# EAGLE design ATMega_16_demo (EAGLE 5.11)
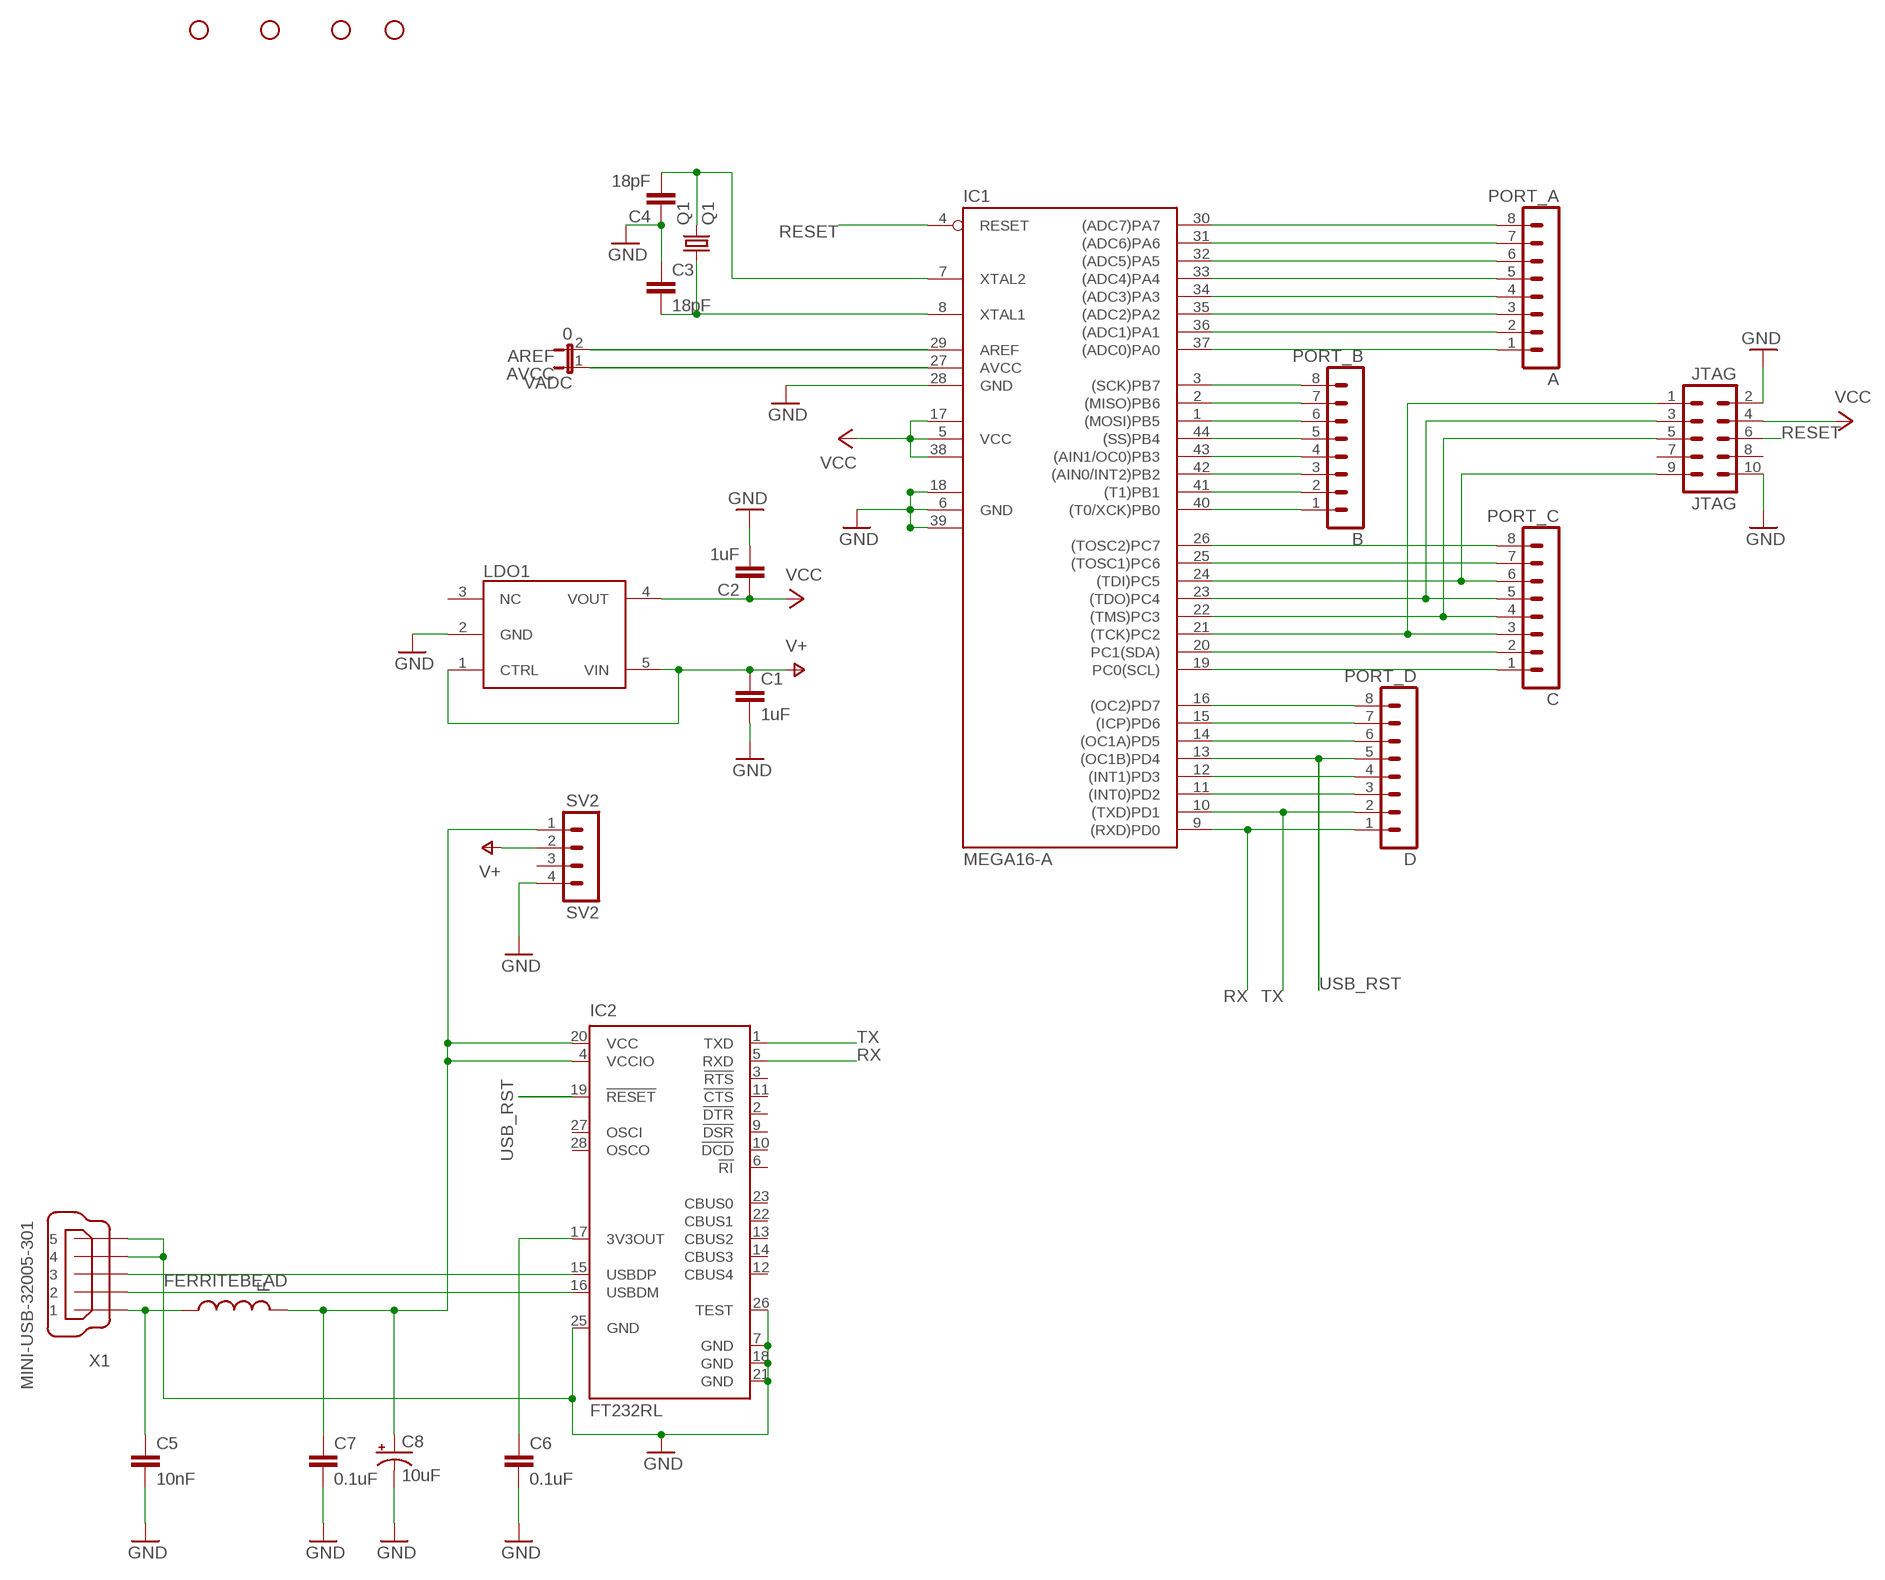
[diagram p0: schematic, sheet 1]

## Parts
C1  1uF  CAP0603-CAP  [0603-CAP]
C2  1uF  CAP0603-CAP  [0603-CAP]
C3  18pF  CAP0603-CAP  [0603-CAP]
C4  18pF  CAP0603-CAP  [0603-CAP]
C5  10nF  CAP0603-CAP  [0603-CAP]
C6  0.1uF  CAP0603-CAP  [0603-CAP]
C7  0.1uF  CAP0603-CAP  [0603-CAP]
C8  10uF  CAP_POL1206  [EIA3216]
FERRITEBEAD  F  INDUCTOR0603  [0603]
IC1  MEGA16-A  [TQFP44]
IC2  FT232RL  [SSOP28]
JP1  STAND-OFF  [STAND-OFF]
JP2  STAND-OFF  [STAND-OFF]
JP3  STAND-OFF  [STAND-OFF]
JP4  STAND-OFF  [STAND-OFF]
JTAG  JTAG  MA05-2  [MA05-2]
LDO1  NJU77X"  [SOT23-5]
PORT_A  A  MA08-1  [MA08-1]
PORT_B  B  MA08-1  [MA08-1]
PORT_C  C  MA08-1  [MA08-1]
PORT_D  D  MA08-1  [MA08-1]
Q1  Q1  CRYSTALHC49S  [HC49/S]
SV2  SV2  MA04-1  [MA04-1]
VADC  0  JUMPER-2PTH  [1X02]
X1  MINI-USB-32005-301  [32005-301]

## Nets
AREF: IC1.29(AREF) VADC.2
AVCC: IC1.27(AVCC) VADC.1
GND: C1.2 C2.2 C3.1 C4.1 C5.2 C6.2 C7.2 C8.C(-) IC1.6(GND) IC1.18(GND1) IC1.28(GND) IC1.39(GND2) IC2.7(GND) IC2.18(GND) IC2.21(GND) IC2.25(GND) IC2.26(TEST) JTAG.2 JTAG.10 LDO1.2(GND) SV2.4 X1.4 X1.5
N$1: IC1.37((ADC0)PA0) PORT_A.1
N$2: IC1.36((ADC1)PA1) PORT_A.2
N$3: IC1.35((ADC2)PA2) PORT_A.3
N$4: IC1.34((ADC3)PA3) PORT_A.4
N$5: IC1.33((ADC4)PA4) PORT_A.5
N$6: IC1.32((ADC5)PA5) PORT_A.6
N$7: IC2.16(USBDM) X1.2
N$8: IC1.30((ADC7)PA7) PORT_A.8
N$9: IC1.40((T0/XCK)PB0) PORT_B.1
N$10: IC1.41((T1)PB1) PORT_B.2
N$11: IC1.42((AIN0/INT2)PB2) PORT_B.3
N$12: IC1.43((AIN1/OC0)PB3) PORT_B.4
N$13: IC1.44((SS)PB4) PORT_B.5
N$14: IC1.1((MOSI)PB5) PORT_B.6
N$15: IC1.2((MISO)PB6) PORT_B.7
N$16: IC1.3((SCK)PB7) PORT_B.8
N$17: IC1.19(PC0(SCL)) PORT_C.1
N$18: IC1.20(PC1(SDA)) PORT_C.2
N$19: IC1.21((TCK)PC2) JTAG.1 PORT_C.3
N$20: IC1.22((TMS)PC3) JTAG.5 PORT_C.4
N$21: IC1.23((TDO)PC4) JTAG.3 PORT_C.5
N$22: IC1.24((TDI)PC5) JTAG.9 PORT_C.6
N$23: IC1.25((TOSC1)PC6) PORT_C.7
N$24: IC1.26((TOSC2)PC7) PORT_C.8
N$27: IC1.11((INT0)PD2) PORT_D.3
N$28: IC1.12((INT1)PD3) PORT_D.4
N$30: IC1.14((OC1A)PD5) PORT_D.6
N$31: IC1.15((ICP)PD6) PORT_D.7
N$32: IC1.16((OC2)PD7) PORT_D.8
N$33: C4.2 IC1.7(XTAL2) Q1.2
N$34: IC2.15(USBDP) X1.3
N$36: C3.2 IC1.8(XTAL1) Q1.1
N$39: C5.1 FERRITEBEAD.1 X1.1
N$40: C6.1 IC2.17(3V3OUT)
PORT_A: IC1.31((ADC6)PA6) PORT_A.7
RESET: IC1.4(RESET) JTAG.6
RX: IC1.9((RXD)PD0) IC2.5(RXD) PORT_D.1
TX: IC1.10((TXD)PD1) IC2.1(TXD) PORT_D.2
USB_RST: IC1.13((OC1B)PD4) IC2.19(!RESET) PORT_D.5
V+: C1.1 LDO1.1(CTRL) LDO1.5(VIN) SV2.2
VCC: C2.1 IC1.5(VCC) IC1.17(VCC1) IC1.38(VCC2) JTAG.4 LDO1.4(VOUT)
VUSB: C7.1 C8.A(+) FERRITEBEAD.2 IC2.4(VCCIO) IC2.20(VCC) SV2.1
Unconnected: IC2.2(!DTR) IC2.3(!RTS) IC2.6(!RI) IC2.9(!DSR) IC2.10(!DCD) IC2.11(!CTS) IC2.12(CBUS4) IC2.13(CBUS2) IC2.14(CBUS3) IC2.22(CBUS1) IC2.23(CBUS0) IC2.27(OSCI) IC2.28(OSCO) JTAG.7 JTAG.8 LDO1.3(NC) SV2.3

## Library data of the parts
C1-C7 = SparkFun:CAP: Capacitor Standard 0603 ceramic capacitor, and 0.1" leaded capacitor.
C8 = SparkFun:CAP_POL: Capacitor Polarized These are standard SMD and PTH capacitors. Normally 10uF, 47uF, and 100uF in electrolytic and tantalum varieties. Always verify the external diameter of the through hole cap, it varies with capacity, voltage, and manufacturer. The EIA devices should be standard.
FERRITEBEAD = SparkFun:INDUCTOR: Inductors Basic Inductor/Choke - 0603 and 1206. Footprints are not proven and vary greatly between part numbers.
IC1 = atmel:MEGA16: MICROCONTROLLER 16 Kbytes FLASH 1 kbytes SRAM 512 bytes EEPROM USART 8-channel 10 bit ADC Source: avr.lbr
IC2 = ftdichip:FT232R: Source: http://www.ftdichip.com/Documents/DataSheets/DS_FT232R_v104.pdf
JP1-JP4 = SparkFun:STAND-OFF: Stand Off This is the mechanical footprint for a #4 phillips button head screw. Use the keepout ring to avoid running the screw head into surrounding components. SKU : PRT-00447
JTAG = con-lstb:MA05-2: PIN HEADER
LDO1 = cjjano:NJU77X: LOW DROPOUT VOLTAGE REGULATOR
PORT_A PORT_B PORT_C PORT_D = con-lstb:MA08-1: PIN HEADER
Q1 = crystal:CRYSTAL: CRYSTAL
SV2 = con-lstb:MA04-1: PIN HEADER
VADC = SparkFun:JUMPER-2: Jumper Basic 0.1" spaced jumper. Use with breakaway headers.
X1 = con-cypressindustries:MINI-USB-: MINI USB-B Conector Source: www.cypressindustries.com

## Board
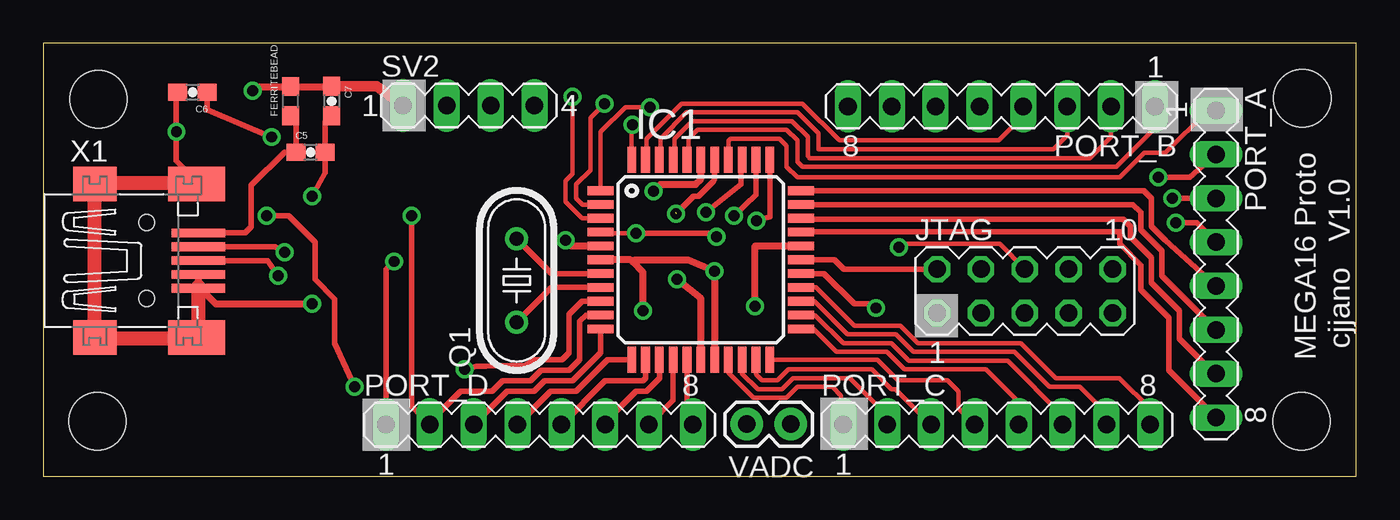
[diagram p1: board, top side]
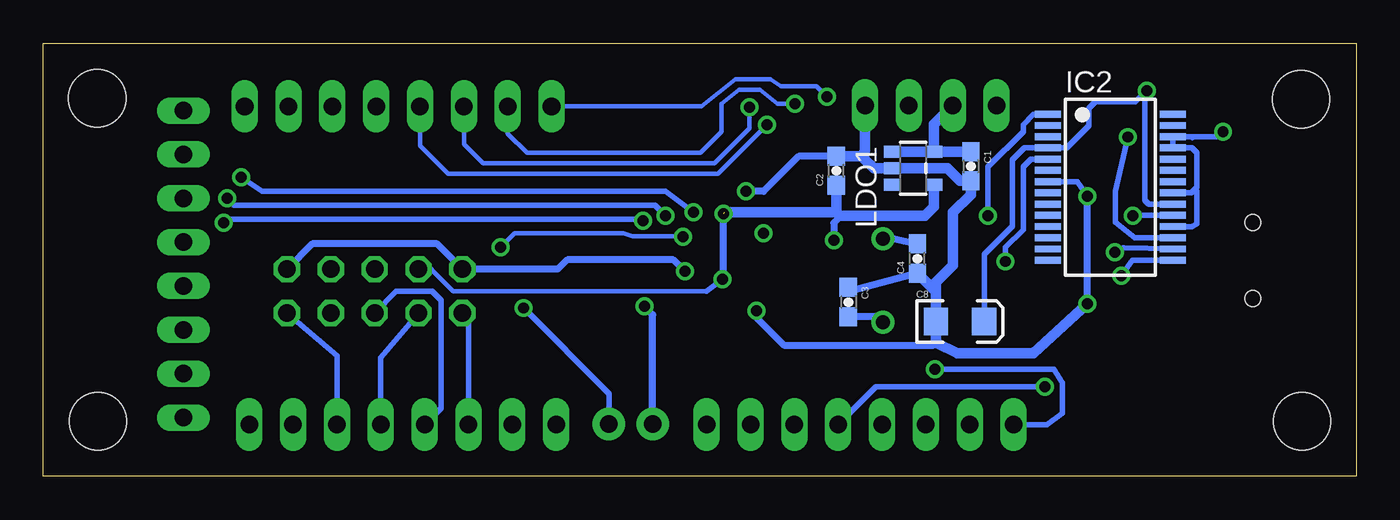
[diagram p2: board, bottom side, seen from below]

Size 76.08 x 25.09 mm. Coordinates in mm from the lower left corner, seen from the top.
Outline: 0,0 76.08,0 76.08,25.09 0,25.09 0,0
Copper layers (1*16): Top 0.035mm / dielectric 1.5mm / Bottom 0.035mm
Design rules "default *": minimum track width 10mil, minimum drill 24mil, track to track 8mil, track to pad 8mil, pad to pad 8mil, via to via 8mil, smd to smd 8mil, copper to edge 40mil, drill to drill 8mil, minimum pad ring 10mil, minimum via ring 8mil, stop-mask expansion 4mil, vias tented up to drill 0mil, thermal gap 10mil

### Footprints (pad centres in the part's own frame; a part is rotated, then mirrored left to right if it is on the bottom)
0603-CAP = smd 1.1 x 1: 1 -0.85,0; 2 0.85,0
EIA3216 = smd 1.4 x 1.6: A 1.4,0; C -1.4,0
0603 = smd 1.1 x 1: 1 -0.85,0; 2 0.85,0
TQFP44 = smd 1.5 x 0.5: 1 -5.8,4; 2 -5.8,3.2; 3 -5.8,2.4; 4 -5.8,1.6; 5 -5.8,0.8; 6 -5.8,0; 7 -5.8,-0.8; 8 -5.8,-1.6; 9 -5.8,-2.4; 10 -5.8,-3.2; 11 -5.8,-4; 23 5.8,-4; 24 5.8,-3.2; 25 5.8,-2.4; 26 5.8,-1.6; 27 5.8,-0.8; 28 5.8,0; 29 5.8,0.8; 30 5.8,1.6; 31 5.8,2.4; 32 5.8,3.2; 33 5.8,4 | smd 0.5 x 1.5: 12 -4,-5.8; 13 -3.2,-5.8; 14 -2.4,-5.8; 15 -1.6,-5.8; 16 -0.8,-5.8; 17 0,-5.8; 18 0.8,-5.8; 19 1.6,-5.8; 20 2.4,-5.8; 21 3.2,-5.8; 22 4,-5.8; 34 4,5.8; 35 3.2,5.8; 36 2.4,5.8; 37 1.6,5.8; 38 0.8,5.8; 39 0,5.8; 40 -0.8,5.8; 41 -1.6,5.8; 42 -2.4,5.8; 43 -3.2,5.8; 44 -4,5.8
SSOP28 = smd 0.4 x 1.5: 1 -4.225,-3.625; 2 -3.575,-3.625; 3 -2.925,-3.625; 4 -2.275,-3.625; 5 -1.625,-3.625; 6 -0.975,-3.625; 7 -0.325,-3.625; 8 0.325,-3.625; 9 0.975,-3.625; 10 1.625,-3.625; 11 2.275,-3.625; 12 2.925,-3.625; 13 3.575,-3.625; 14 4.225,-3.625; 15 4.225,3.625; 16 3.575,3.625; 17 2.925,3.625; 18 2.275,3.625; 19 1.625,3.625; 20 0.975,3.625; 21 0.325,3.625; 22 -0.325,3.625; 23 -0.975,3.625; 24 -1.625,3.625; 25 -2.275,3.625; 26 -2.925,3.625; 27 -3.575,3.625; 28 -4.225,3.625
STAND-OFF = hole 3.302: 0,0
MA05-2 = drill 1.016 octagon: 1 -5.08,-1.27; 2 -5.08,1.27; 3 -2.54,-1.27; 4 -2.54,1.27; 5 0,-1.27; 6 0,1.27; 7 2.54,-1.27; 8 2.54,1.27; 9 5.08,-1.27; 10 5.08,1.27
SOT23-5 = smd 0.7 x 1: 1 0.95,1.2; 2 0,1.2; 3 -0.95,1.2; 4 -0.95,-1.2; 5 0.95,-1.2
MA08-1 = drill 1.016 long: 1 -8.89,0; 2 -6.35,0; 3 -3.81,0; 4 -1.27,0; 5 1.27,0; 6 3.81,0; 7 6.35,0; 8 8.89,0
HC49/S = drill 0.813 round: 1 -2.413,0; 2 2.413,0
MA04-1 = drill 1.016 long: 1 -3.81,0; 2 -1.27,0; 3 1.27,0; 4 3.81,0
1X02 = drill 1.016 pad 1.88 round: 1 0,0; 2 2.54,0
32005-301 = smd 3.1 x 0.5: 1 3,1.6; 2 3,0.8; 3 3,0; 4 3,-0.8; 5 3,-1.6 | smd 2.5 x 2: M1 -3,-4.45; M2 -3,4.45 | smd 3.3 x 2: M3 2.9,4.45; M4 2.9,-4.45 | hole 0.9: 0,2.2; 0,-2.2

### Placement (x,y rotation side)
C1  22.33,17.97 270 bottom
C2  30.13,17.7 90 bottom
C3  29.43,10.1 270 bottom
C4  25.43,12.62 90 bottom
C5  15.5,18.78 0 top
C6  8.66,22.25 180 top
C7  16.71,21.74 270 top
C8  22.97,8.97 0 bottom
FERRITEBEAD  14.34,21.73 90 top
IC1  38.1,12.55 0 top
IC2  14.25,16.75 270 bottom
JP1  3.15,3.2 0 top
JP2  72.9,3.2 0 top
JP3  72.95,21.9 0 top
JP4  3.2,21.84 0 top
JTAG  56.87,10.74 0 top
LDO1  25.67,17.85 90 bottom
PORT_A  67.95,12.3 270 top
PORT_B  55.52,21.44 180 top
PORT_C  55.25,3 0 top
PORT_D  28.75,3 0 top
Q1  27.43,11.35 90 top
SV2  24.66,21.48 0 top
VADC  43.31,3.02 180 top
X1  6,12.5 0 top

### Tracks (layer width: path | path; a pad name or v marks a point on that pad's centre or on a via)
AREF  (via drill 0.64)
  Top 0.406: v41.25,9.85 41.25,13.35 IC1.29
  Bottom 0.254: 40.77,9.35 40.75,9.35
  Bottom 0.406: VADC.2 40.77,9.35 40.77,9.38 | 40.75,9.35 v41.25,9.85
AVCC  (via drill 0.64)
  Top 0.305: IC1.27 45.25,11.75 46.99,10.01 48.01,10.01 v48.26,9.76
  Bottom 0.305: v48.26,9.76 43.31,4.8 VADC.1
GND  (via drill 0.64)
  Top 0.305: C7.2 16.35,20.53 C5.2 16.35,17.6 v15.59,16.23 | C6.2 7.72,22.17 v7.72,19.97 7.72,18.28 9,17 | IC1.28 45.85,12.55 46.39,12 JTAG.2
  Top 0.406: v15.59,10 10,10 9,11 | 9,11 X1.5 | 9,11 X1.4 | IC1.39 38.1,17.22 37.8,16.92 35.76,16.92 v35.36,16.51 | IC1.6 34.04,12.55 34.16,12.42 | 34.16,12.42 34.75,11.84 v34.75,9.6 | IC1.18 v38.9,11.88 37.34,12.55 34.29,12.55 34.16,12.42
  Top 0.813: 9,11 9,8 3,8 3,17 9,17
  Bottom 0.254: 9.5,19.68 9.5,19.6 | JTAG.10 61.75,12.35
  Bottom 0.305: IC2.7 16.18,17.08 v15.59,16.23 | v7.72,19.97 8.01,19.68 9.5,19.68 IC2.26 IC2.25 9.53,19.03 9.25,18.75 9.25,16.75 9.57,16.43 IC2.21 9.68,16.43 9.25,16.51 9.25,14.62 9.53,14.47 IC2.18
  Bottom 0.406: C3.1 29.23,10.75 C4.1 | v15.59,10 v15.59,16.23 | JTAG.10 60.49,13.46 53.25,13.46 JTAG.2 46.27,12 45.72,12.55 39.57,12.55 v38.9,11.88 | v35.36,16.51 34.34,16.51 32.31,18.54 C2.2 | v34.75,9.6 34.75,9.2 33.12,7.57 24.55,7.57 24.36,7.76
  Bottom 0.61: SV2.4 28.46,18.93 28.55,18.44 | C2.2 28.66,18.55 28.55,18.44 | 28.55,18.44 27.95,17.85 LDO1.2 23.69,17.85 22.95,17.12 C1.2 22.33,16.33 23.37,15.29 23.37,12.24 24.36,11.25 C8.C | C4.1 24.36,10.7 C8.C | C8.C 24.36,7.76 23.11,7.14 18.71,7.14 v15.59,10
N$1
  Top 0.254: IC1.37 39.7,19.43 39.83,19.56 42.67,19.56 43.08,19.15 43.08,17.94 43.69,17.33 62.38,17.33 63.8,18.75 65.02,18.75 67.47,21.19 PORT_A.1
N$2  (via drill 0.64)
  Top 0.305: PORT_A.2 66.42,17.33 v64.62,17.33 | IC1.36 40.44,18.29 40.44,16.92 v38.41,15.29
  Bottom 0.305: v64.62,17.33 63.4,16.51 40.03,16.51 v38.41,15.29
N$3  (via drill 0.64)
  Top 0.305: PORT_A.3 v65.43,16.11 | IC1.35 41.3,16.31 v40.03,15.09
  Bottom 0.305: v65.43,16.11 65.02,15.7 40.64,15.7 v40.03,15.09
N$4  (via drill 0.64)
  Top 0.305: PORT_A.4 66.84,14.68 v65.63,14.68 | v41.33,14.81 42.1,15.05 IC1.34
  Bottom 0.305: v65.63,14.68 65.43,14.89 41.86,14.89 v41.33,14.81
N$5
  Top 0.305: IC1.33 63.77,16.55 64.21,16.11 64.21,14.48 65.02,13.67 65.92,12.86 PORT_A.5
N$6
  Top 0.305: PORT_A.6 64.82,11.62 64.82,13.06 63.6,14.28 63.6,15.29 63.15,15.75 IC1.32
N$7  (via drill 0.64)
  Top 0.305: X1.2 13.44,13.3 v14,13
  Bottom 0.305: v14,13 13.49,13.25 IC2.16
N$8
  Top 0.305: PORT_A.8 67.95,3.43 65.23,6.15 65.23,9.2 63.6,10.82 63.6,12.24 62.38,13.46 62.38,14.18 43.93,14.18 IC1.30
N$9
  Top 0.254: PORT_B.1 64.41,20.16 62.18,17.94 43.99,17.94 43.69,18.24 43.69,19.46 43.08,20.07 37.9,20.07 37.39,19.56 37.39,18.44 IC1.40
N$10
  Top 0.254: PORT_B.2 61.87,19.65 60.66,18.44 44.4,18.44 44.3,18.54 44.3,19.66 43.38,20.58 37.59,20.58 36.58,19.56 36.58,18.43 IC1.41
N$11
  Top 0.254: PORT_B.3 59.33,19.76 58.52,18.95 44.91,18.95 44.91,19.87 43.69,21.08 37.29,21.08 35.76,19.56 35.76,18.41 IC1.42
N$12
  Top 0.254: PORT_B.4 56.79,20.87 55.37,19.46 46.13,19.46 43.99,21.59 36.98,21.59 34.95,19.56 34.95,18.4 IC1.43
N$13  (via drill 0.64)
  Top 0.254: IC1.44 34.1,20.34 v34.14,20.37
  Bottom 0.254: PORT_B.5 54.25,19.15 52.63,17.53 36.98,17.53 v34.14,20.37
N$14  (via drill 0.64)
  Top 0.254: IC1.1 32.3,19.96 33.73,21.39 v35.15,21.39
  Bottom 0.254: PORT_B.6 51.71,19.25 50.6,18.14 37.19,18.14 35.15,20.17 v35.15,21.39
N$15  (via drill 0.64)
  Top 0.254: IC1.2 31.24,15.75 30.89,16.11 30.89,16.92 31.7,17.73 31.7,20.78 v32.51,21.59
  Bottom 0.254: PORT_B.7 49.17,19.86 48.06,18.75 38,18.75 36.78,19.97 36.78,21.59 35.76,22.41 34.54,22.41 33.53,21.59 v32.51,21.59
N$16  (via drill 0.64)
  Top 0.254: IC1.3 31.23,14.95 30.28,15.9 30.28,17.12 30.68,17.53 v30.68,22
  Bottom 0.254: PORT_B.8 37.95,21.44 35.97,23.02 33.93,23.02 33.33,22.61 31.29,22.61 v30.68,22
N$17
  Top 0.254: IC1.19 39.7,6 41.15,4.55 43.05,4.55 43.69,5.18 45.72,5.18 46.23,4.68 46.23,3.13 PORT_C.1
N$18
  Top 0.254: IC1.20 40.5,5.96 41.4,5.06 42.8,5.06 43.43,5.69 46.74,5.69 48.9,3.53 PORT_C.2
N$19
  Top 0.254: IC1.21 41.3,5.92 41.66,5.56 42.55,5.56 43.18,6.2 48.01,6.2 49.15,5.06 49.38,5.06 PORT_C.3
  Bottom 0.305: PORT_C.3 51.44,8.91 JTAG.1
N$20
  Top 0.254: IC1.22 48.34,6.76 49.53,5.56 52.4,5.56 53.03,4.93 53.03,3.94 PORT_C.4
  Top 0.305: IC1.22
  Bottom 0.305: JTAG.5 55.62,10.72 53.54,10.72 53.03,10.21 53.03,3.94 PORT_C.4
N$21
  Top 0.254: IC1.23 44.64,8.55 45.97,7.22 48.9,7.22 49.91,6.2 54.61,6.2 56.52,4.29 PORT_C.5
  Bottom 0.305: JTAG.3 56.52,6.87 PORT_C.5
N$22
  Top 0.254: IC1.24 44.73,9.35 46.35,7.72 49.15,7.72 50.16,6.71 55.88,6.71 59.06,3.53 PORT_C.6
  Bottom 0.305: JTAG.9 59.06,6.98 PORT_C.6
N$23
  Top 0.254: IC1.25 44.69,10.15 46.61,8.23 49.4,8.23 50.42,7.22 56.26,7.22 58.29,5.18 60.07,5.18 61.6,3.66 PORT_C.7
N$24
  Top 0.254: IC1.26 44.78,10.95 46.99,8.74 49.66,8.74 50.67,7.72 56.64,7.72 58.67,5.69 62.36,5.69 64.14,3.91 PORT_C.8
N$27
  Top 0.305: IC1.11 32.3,7.16 30.68,5.54 29.06,5.54 28.45,4.93 26.87,4.93 PORT_D.3
N$28
  Top 0.305: IC1.12 32.71,6.75 30.89,4.93 29.41,4.93 PORT_D.4
N$30
  Top 0.305: PORT_D.6 32.56,3.15 34.34,4.93 34.95,4.93 35.7,5.68 IC1.14
N$31
  Top 0.305: PORT_D.7 36.5,4.4 IC1.15
N$32
  Top 0.305: PORT_D.8 37.3,3.34 IC1.16
N$33
  Top 0.305: IC1.7 29.45,11.75 Q1.2
  Bottom 0.406: Q1.2 26.75,13.76 C4.2
N$34  (via drill 0.64)
  Top 0.305: X1.3 13,12.5 v13.63,11.62
  Bottom 0.305: v13.63,11.62 12.97,12.53 IC2.15
N$36
  Top 0.305: IC1.8 29.45,10.95 Q1.1
  Bottom 0.406: C3.2 27.75,9.25 Q1.1
N$39
  Top 0.305: FERRITEBEAD.1 14.65,20.58 C5.1 13.98,18.78 12.06,16.87 12.06,14.46 11.71,14.1 X1.1
N$40  (via drill 0.64)
  Top 0.305: C6.1 9.51,21.25 v13.25,19.66
  Bottom 0.305: IC2.17 12.83,13.82 13.97,14.71 13.97,16.53 v13.25,19.66
PORT_A
  Top 0.305: PORT_A.7 67.86,5.95 65.84,7.98 65.84,9.6 64.21,11.23 64.21,12.65 62.99,13.87 62.99,14.48 62.59,14.89 43.96,14.89 IC1.31
RESET  (via drill 0.64)
  Top 0.254: JTAG.6 55.41,13.46 49.78,13.46 v49.58,13.26 | v34.34,14.07 32.38,14.07 IC1.4
  Top 0.305: v39.01,13.87 38.81,14.07 v34.34,14.07
  Bottom 0.254: v49.58,13.26 48.77,14.07 42.47,14.07 41.94,13.92 39.34,13.92 v39.01,13.87
RX  (via drill 0.64)
  Top 0.305: IC1.9 31.23,10.15 30.48,9.4 30.48,7.17 30.07,6.76 28.45,6.76 27.84,6.4 26.42,6.4 25.63,6.38 25.12,6.38 v24.41,6.2 | v20.32,12.45 19.86,11.99 PORT_D.1
  Bottom 0.305: IC2.5 18.86,18.38 19.3,17.94 19.3,14.28 20.32,13.26 v20.32,12.45 | 19.86,3.86 PORT_D.1 17.93,3 17.02,3.66 17.02,5.44 17.53,6.2 v24.41,6.2
TX  (via drill 0.64)
  Top 0.305: IC1.10 31.45,9.35 31.09,8.99 31.09,6.76 30.48,6.15 28.85,6.15 28.25,5.54 26.62,5.54 26.01,4.93 24.18,4.93 22.4,3.15 PORT_D.2 21.34,4.06 v21.34,15.09
  Bottom 0.305: IC2.1 18.7,20.98 19.3,20.37 19.3,19.97 21.34,17.94 v21.34,15.09
USB_RST  (via drill 0.64)
  Top 0.305: IC1.13 34.9,5.69 34.75,5.54 32.56,5.54 PORT_D.5 | v12.95,15.09 14.22,15.09 15.75,13.57 15.75,11.41 16.89,10.26 16.89,7.72 v18.03,5.18
  Bottom 0.305: IC2.19 12.92,15.12 v12.95,15.09 | v18.03,5.18 27.84,5.18 PORT_D.5
V+
  Bottom 0.61: LDO1.5 LDO1.1 | LDO1.5 22.35,18.8 C1.1 | LDO1.5 24.47,20.4 SV2.2
VCC  (via drill 0.64)  (1 unrouted)
  Top 0.305: IC1.38 38.9,17.21 38.82,17.08 37.97,16.23 37.67,16.23 v36.65,15.22
  Top 0.406: IC1.17 38.1,10.31 v36.73,11.43 | IC1.5 30.59,13.35 v30.28,13.67
  Bottom 0.254: 53.61,12 52.32,10.72 37.64,10.72
  Bottom 0.305: 53.61,12 JTAG.4 | 37.64,10.72 v36.73,11.43 36.65,11.51
  Bottom 0.406: v30.28,13.67 30.28,14.68 29.87,15.09 | 36.65,11.51 v36.65,15.22
  Bottom 0.61: 30.13,15.29 C2.1 | 30.13,15.29 29.93,15.09 29.87,15.09 24.99,15.09 24.47,15.61 LDO1.4 | 30.13,15.29 36.63,15.29
VUSB  (via drill 0.64)
  Top 0.406: C7.1 FERRITEBEAD.2 12.38,22.58 v12.14,22.34
  Top 0.61: SV2.1 19.33,22.59 C7.1
  Bottom 0.305: IC2.20 12.03,15.78 12.25,16 12.25,22.23 v12.14,22.34 12.79,21.69 15.11,21.69 15.49,21.31 15.49,20.3 16.77,19.03 IC2.4 19.23,19.03 19.91,18.34 19.91,14.48 21.54,12.86 21.54,9.55 C8.A

### Text on the board
tPlace: cjjano V1.0 | MEGA16 Proto